# Altium project remote-38k-6key.PrjPcb
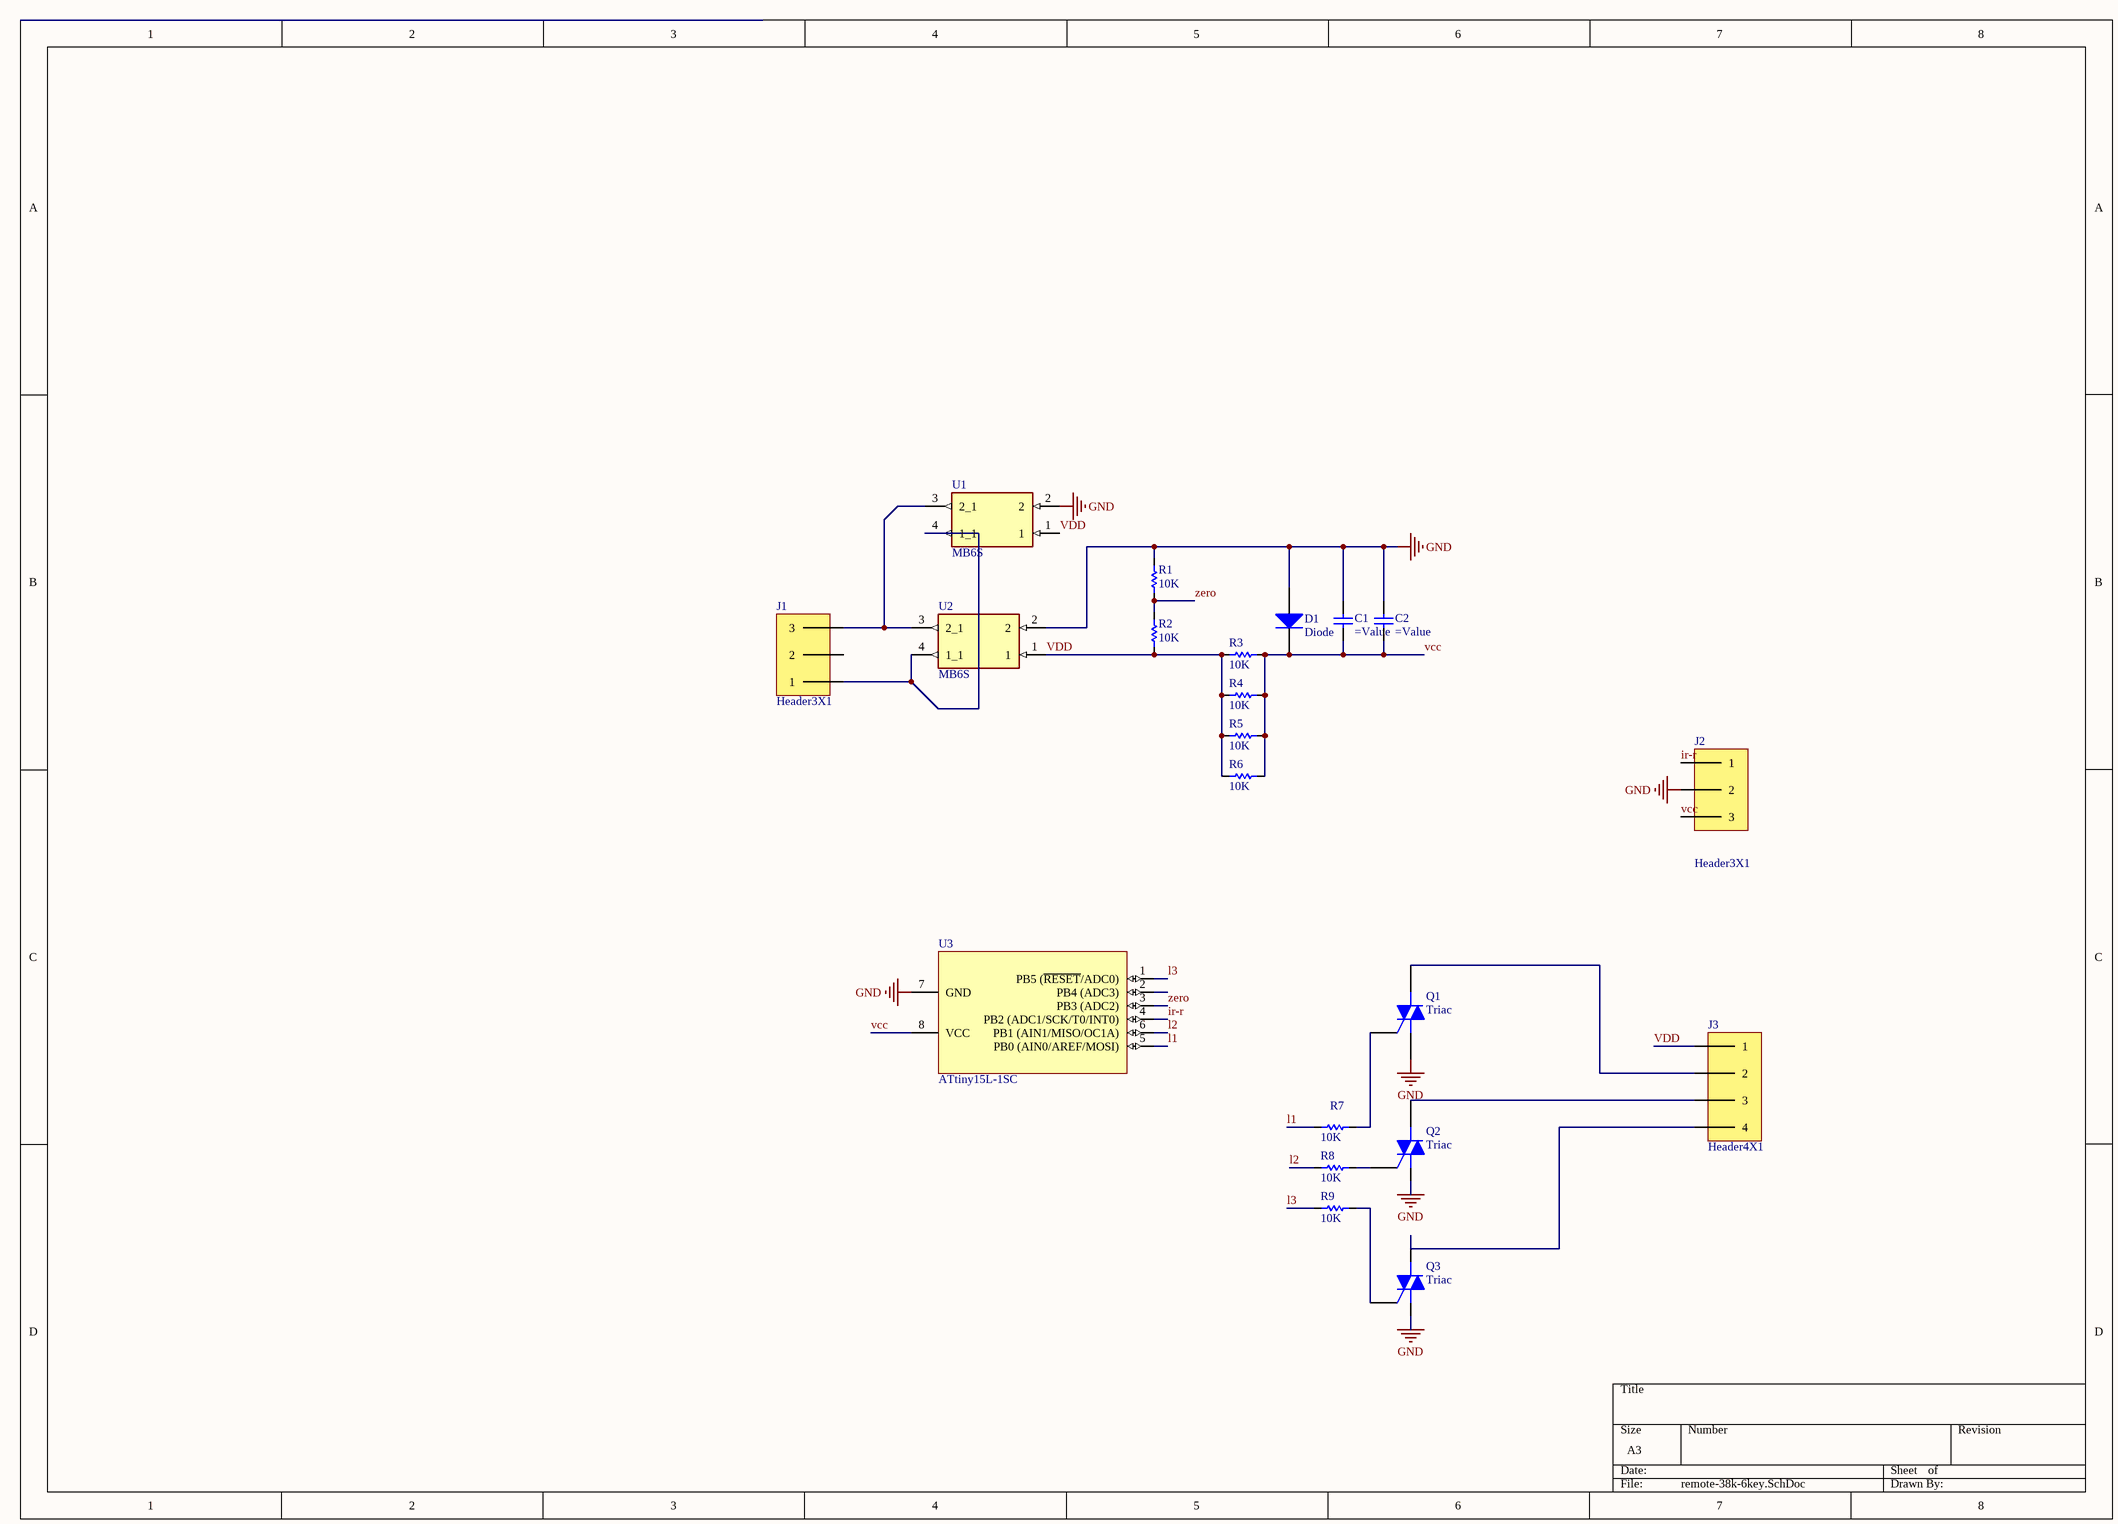
[diagram p0: remote-38k-6key.SchDoc]
1 sheet, 21 parts. Net scope: global (net labels, ports and power ports of the same name join across sheets).
Board file: remote-38k-6key-v2.PcbDoc

## Sheet remote-38k-6key.SchDoc
size A3

### Parts
C1  (no value)  [CAP 1206]
C2  (no value)  [CAP 1206]
D1  Diode  [C1206]
J1  Header3X1  [HEADER 3X1]
J2  Header3X1  [HEADER 3X1]
J3  Header4X1  [HEADER 4X1]
Q1  Triac  [SOT89N]
Q2  Triac  [SOT89N]
Q3  Triac  [SOT89N]
R1  10K  [RES 1206 (3216X08L)]
R2  10K  [RES 1206 (3216X08L)]
R3  10K  [RES 2010 (5026X08L)]
R4  10K  [RES 2010 (5026X08L)]
R5  10K  [RES 2010 (5026X08L)]
R6  10K  [RES 2010 (5026X08L)]
R7  10K  [RES 1206 (3216X08L)]
R8  10K  [RES 1206 (3216X08L)]
R9  10K  [RES 1206 (3216X08L)]
U1  MB6S  [SOIC245P670X270-4N]
U2  MB6S  [SOIC245P670X270-4N]
U3  ATtiny15L-1SC  [8S2_N]

### Nets
GND: C1.2(-) C2.2(-) D1.1(A) J2.2 Q1.1(M1) Q2.1(M1) Q3.1(M1) R1.2 U1.2 U2.2 U3.7(GND)
ir-r: J2.1 U3.4(PB2_(ADC1/SCK/T0/INT0))
l1: R7.1 U3.5(PB0_(AIN0/AREF/MOSI))
l2: R8.1 U3.6(PB1_(AIN1/MISO/OC1A))
l3: R9.1 U3.1(PB5_(~{RESET}/ADC0))
vcc: C1.1(+) C2.1(+) D1.2(K) J2.3 R3.2 R4.2 R5.2 R6.2 U3.8(VCC)
VDD: J3.1 R2.1 R3.1 R4.1 R5.1 R6.1 U1.1 U2.1
zero: R1.1 R2.2 U3.3(PB3_(ADC2))
NetJ1_1: J1.1 U1.4(1_1) U2.4(1_1)
NetJ1_3: J1.3 U1.3(2_1) U2.3(2_1)
NetJ3_2: J3.2 Q1.2(M2)
NetJ3_3: J3.3 Q2.2(M2)
NetJ3_4: J3.4 Q3.2(M2)
NetQ1_3: Q1.3(G) R7.2
NetQ2_3: Q2.3(G) R8.2
NetQ3_3: Q3.3(G) R9.2

Not connected (* = marked no-connect by the designer): J1 2; U3 2(PB4_(ADC3))

### Library data of the parts
C1 C2 = Capacitor
D1 = Diode: Default Diode; Published: 8-Jun-2000; LatestRevisionDate: 17-Jul-2002; LatestRevisionNote: Re-released for DXP Platform.; PackageVersion: Sep-1996; PackageReference: SMC; Publisher: Altium Limited; PackageDescription: DO-214-AB/SMC; 2 C-Bend Leads; Body 7.9 x 5.9 mm, inc. leads (LxW); Code_JEDEC: DO-214-AB
Q1-Q3 = Triac: Silicon Bidirectional Triode Thyristor; pin to pad: 1>3 3>1; Note: Pin 2 is electrically connected to Pin 4 (TAB); Published: 29-Sep-2000; LatestRevisionDate: 17-Jul-2002; LatestRevisionNote: Re-released for DXP Platform.; DatasheetVersion: 1999; PackageReference: 369-03; Publisher: Altium Limited; PackageDescription: TO, Thru-Hole, Vertical, Heatsink Mounted; 3 In-Line Leads; Pitch 2.28 mm; ComponentLink1Description: Manufacturer Link; ComponentLink1URL: http://www.motorola.com/
R1-R9 = Resistor: Tolerance: 5%; Power: 1/4 W; Value: 10K
U1 U2 = MB6S: Bridge Rectifier Single Phase Standard 600V Surface Mount 4-SOIC; MF: ON Semiconductor; Digi-Key_Purchase_URL: https://www.digikey.com.tr/product-detail/en/on-semiconductor/MB6S/MB6SCT-ND/965654?utm_source=snapeda&utm_medium=aggregator&utm_campaign=symbol; Value: *; Package: BESOP-4 Surge Components; Digi-Key_Part_Number: MB6SCT-ND; SnapEDA_Link: https://www.snapeda.com/parts/MB6S/ON%20Semiconductor/view-part/2774209/?ref=snap; MP: MB6S
U3 = ATtiny15L-1SC: 8-Bit AVR Microcontroller with 1K Byte of Flash Memory; pin to pad: 1>7 7>8 8>1; Published: 17-Sep-2003; LatestRevisionDate: 16-Oct-2006; LatestRevisionNote: IPC-7351 Footprint Added.; DatasheetVersion: 1187E-AVR-06/02; PackageVersion: revF, Apr-2008; PackageReference: 8S2; Publisher: Altium Limited; PackageDescription: 8-Lead, 0.208" Body, Plastic Small Outline Package (EIAJ); Supplier 1: Digi-Key; Supplier Part Number 1: ATTINY15L-1SC-ND; Supplier 2: Mouser; Supplier Part Number 2: 556-ATTINY15L1SC; ComponentLink1Description: Datasheet; ComponentLink1URL: http://www.atmel.com/dyn/resources/prod_documents/doc1187.pdf; ComponentLink2Description: Atmel.com Home; ComponentLink2URL: http://www.atmel.com